# Altium schematic sheet ethernet_connectors.SchDoc
size A3; Organization: Develer s.r.l.; Address1: via Mugellese 1/A; Address2: 50019 Campi Bisenzio; Address3: Firenze; Address4: ITALY; Revision: A; SheetNumber: 1; SheetTotal: 1
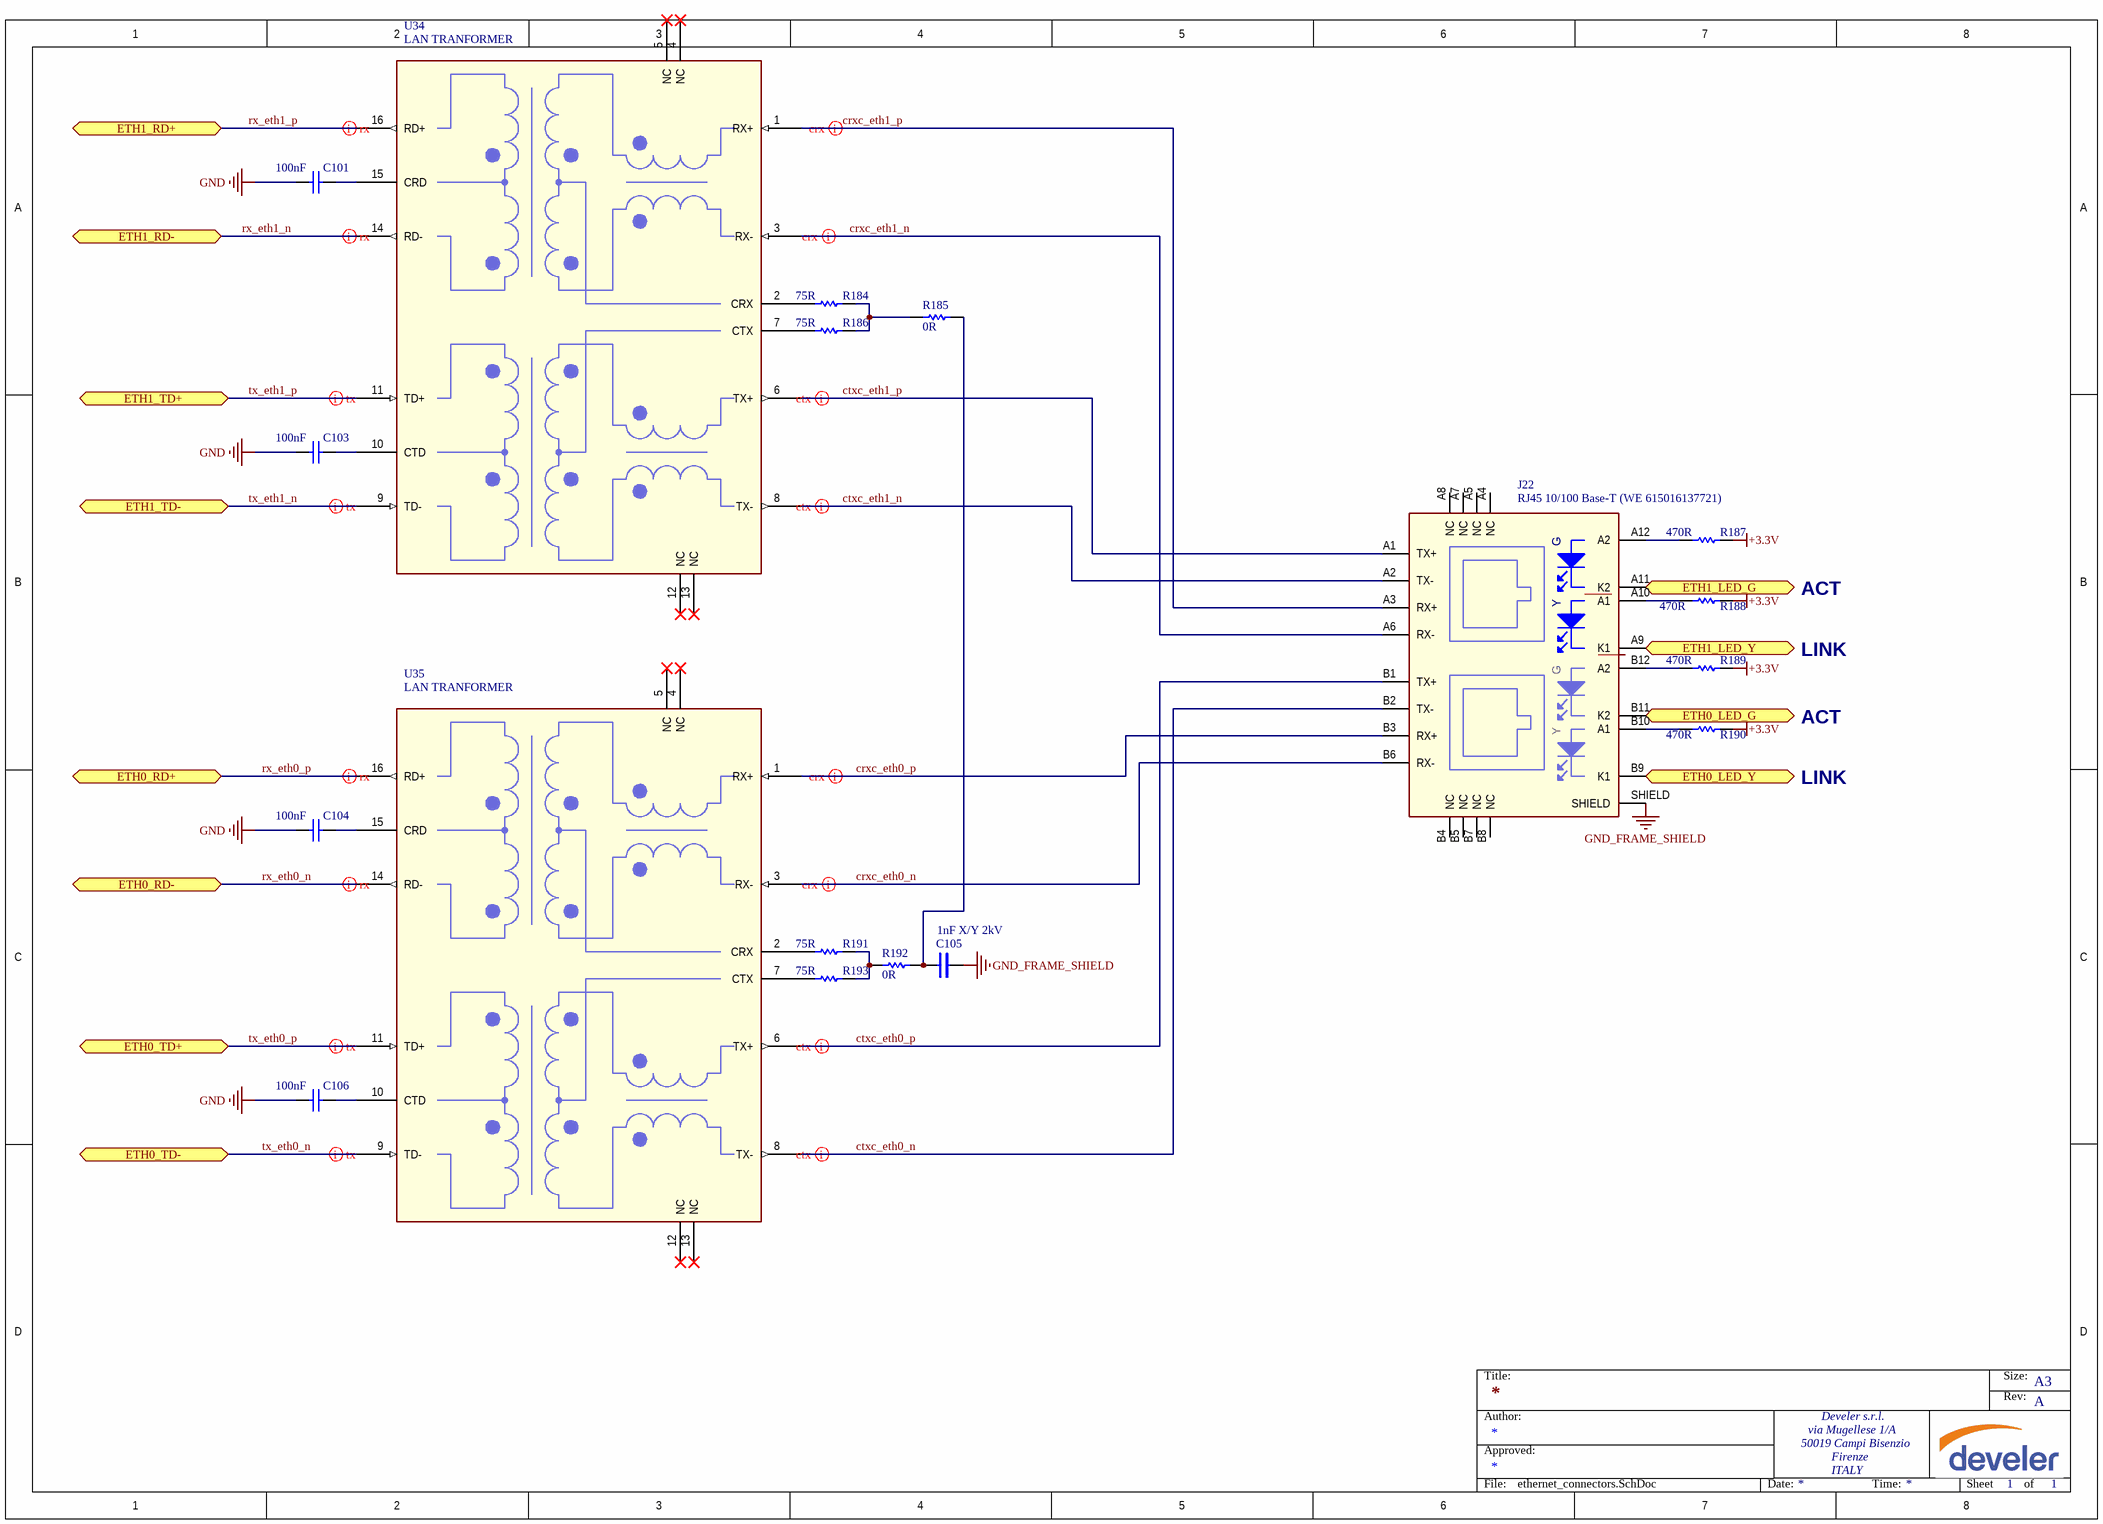
[diagram p0: ethernet_connectors.SchDoc]

## Parts
C101  100nF  [0603_[1608]]
C103  100nF  [0603_[1608]]
C104  100nF  [0603_[1608]]
C105  1nF X/Y 2kV  [1808_[4520]]
C106  100nF  [0603_[1608]]
J22  RJ45 10/100 Base-T (WE 615016137721)  [RJ45_HORIZONTAL_CON_DUAL]
R184  75R  [0603_[1608]]
R185  0R  [0603_[1608]]
R186  75R  [0603_[1608]]
R187  470R  [0603_[1608]]
R188  470R  [0603_[1608]]
R189  470R  [0603_[1608]]
R190  470R  [0603_[1608]]
R191  75R  [0603_[1608]]
R192  0R  [0603_[1608]]
R193  75R  [0603_[1608]]
U34  LAN TRANFORMER  [LAN_TR_1.27MM_SMD]
U35  LAN TRANFORMER  [LAN_TR_1.27MM_SMD]

## Ports
ETH0_LED_G, ETH0_LED_Y, ETH0_RD+, ETH0_RD-, ETH0_TD+, ETH0_TD-, ETH1_LED_G, ETH1_LED_Y, ETH1_RD+, ETH1_RD-, ETH1_TD+, ETH1_TD-

## Nets
+3.3V: R187.1 R188.1 R189.1 R190.1
GND: C101.2 C103.2 C104.2 C106.2
GND_FRAME_SHIELD: C105.2 J22.SHIELD
crxc_eth0_n: J22.B6(RX-) U35.3(RX-)
crxc_eth0_p: J22.B3(RX+) U35.1(RX+)
crxc_eth1_n: J22.A6(RX-) U34.3(RX-)
crxc_eth1_p: J22.A3(RX+) U34.1(RX+)
ctxc_eth0_n: J22.B2(TX-) U35.8(TX-)
ctxc_eth0_p: J22.B1(TX+) U35.6(TX+)
ctxc_eth1_n: J22.A2(TX-) U34.8(TX-)
ctxc_eth1_p: J22.A1(TX+) U34.6(TX+)
ETH0_LED_G: J22.B11(K2) ; port ETH0_LED_G
ETH0_LED_Y: J22.B9(K1) ; port ETH0_LED_Y
ETH1_LED_G: J22.A11(K2) ; port ETH1_LED_G
ETH1_LED_Y: J22.A9(K1) ; port ETH1_LED_Y
rx_eth0_n: U35.14(RD-) ; port ETH0_RD-
rx_eth0_p: U35.16(RD+) ; port ETH0_RD+
rx_eth1_n: U34.14(RD-) ; port ETH1_RD-
rx_eth1_p: U34.16(RD+) ; port ETH1_RD+
tx_eth0_n: U35.9(TD-) ; port ETH0_TD-
tx_eth0_p: U35.11(TD+) ; port ETH0_TD+
tx_eth1_n: U34.9(TD-) ; port ETH1_TD-
tx_eth1_p: U34.11(TD+) ; port ETH1_TD+
NetC101_1: C101.1 U34.15(CRD)
NetC103_1: C103.1 U34.10(CTD)
NetC104_1: C104.1 U35.15(CRD)
NetC105_1: C105.1 R185.1 R192.1
NetC106_1: C106.1 U35.10(CTD)
NetJ22_A10: J22.A10(A1) R188.2
NetJ22_A12: J22.A12(A2) R187.2
NetJ22_B10: J22.B10(A1) R190.2
NetJ22_B12: J22.B12(A2) R189.2
NetR184_1: R184.1 R185.2 R186.1
NetR184_2: R184.2 U34.2(CRX)
NetR186_2: R186.2 U34.7(CTX)
NetR191_1: R191.1 R192.2 R193.1
NetR191_2: R191.2 U35.2(CRX)
NetR193_2: R193.2 U35.7(CTX)

Not connected (* = marked no-connect by the designer): J22 A4(NC) A5(NC) A7(NC) A8(NC) B4(NC) B5(NC) B7(NC) B8(NC); U34 4(NC)* 5(NC)* 12(NC)* 13(NC)*; U35 4(NC)* 5(NC)* 12(NC)* 13(NC)*

## Layout directives
differential pair: crxc_eth0_n, crxc_eth0_p, crxc_eth1_n, crxc_eth1_p, ctxc_eth0_n, ctxc_eth0_p, ctxc_eth1_n, ctxc_eth1_p, rx_eth0_n, rx_eth0_p, rx_eth1_n, rx_eth1_p, tx_eth0_n, tx_eth0_p, tx_eth1_n, tx_eth1_p

## Notes on the sheet
- ACT
- LINK
- Title:
- Size:
- Rev:
- A3
- Author:
- Approved:
- File:
- Date:
- Time:
- Sheet
- of
- (in symbol RJ45_10/100Base-T_Dual_connector) G; Y

## Library data of the parts
C101 C103 C104 C106 = Cap: Ceramic X7R 50V; Value: 10nF; Published: 8-Jun-2000; Revision: July-2002: Re-released for DXP Platform.; Publisher: Altium Limited
C105 = cap_xy: CER 250VAC X7R X1/Y1 (GA342DR7GF102KW)
J22 = RJ45_10/100Base-T_Dual_connector: RJ45 10/100 Base-T Dual (WE 615016137721)
R184 R186 R191 R193 = Res1: Resistor; Revision: July-2002: Re-released for DXP Platform.
R185 R192 = Res1: Resistor; Value: 0; Published: 8-Jun-2000; LatestRevisionDate: 17-Jul-2002; LatestRevisionNote: Re-released for DXP Platform.; PackageReference: AXIAL-0.3; Publisher: Altium Limited; PackageDescription: Axial Device, Thru-Hole; 2 Leads; 0.3 in Pin Spacing
R187-R190 = Res1: Resistor; Value: 1K; Published: 8-Jun-2000; Revision: July-2002: Re-released for DXP Platform.; Publisher: Altium Limited
U34 U35 = LAN-TR-WE749010014: WE 749010011; WE 7490100111A; WE 7490100161A;